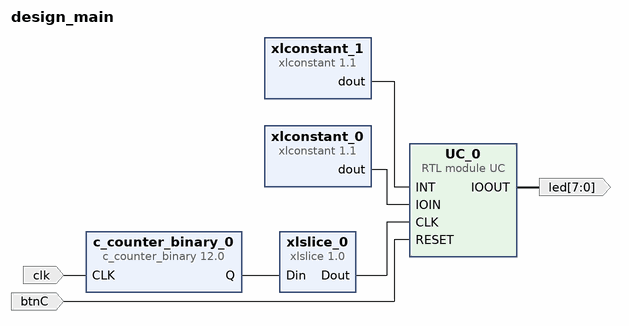
[diagram p0: block diagram of the top level]
# Vivado block design design_main, xc7a35tcpg236-1, Vivado 2020.2
create_bd_design design_main

create_bd_port -dir O -from 7 -to 0 led
create_bd_port -dir I -type clk clk
set_property -dict {CONFIG.FREQ_HZ 10000000} [get_bd_ports clk]
create_bd_port -dir I -type rst btnC

create_bd_cell -type ip -vlnv xilinx.com:ip:c_counter_binary:12.0 c_counter_binary_0
set_property -dict {CONFIG.Output_Width 24 CONFIG.SCLR false} [get_bd_cells c_counter_binary_0]
create_bd_cell -type ip -vlnv xilinx.com:ip:xlslice:1.0 xlslice_0
set_property -dict {CONFIG.DIN_FROM 23 CONFIG.DIN_TO 23 CONFIG.DIN_WIDTH 24} [get_bd_cells xlslice_0]
create_bd_cell -type ip -vlnv xilinx.com:ip:xlconstant:1.1 xlconstant_0
set_property -dict {CONFIG.CONST_VAL 00000000 CONFIG.CONST_WIDTH 8} [get_bd_cells xlconstant_0]
create_bd_cell -type ip -vlnv xilinx.com:ip:xlconstant:1.1 xlconstant_1
set_property -dict {CONFIG.CONST_VAL 0} [get_bd_cells xlconstant_1]
create_bd_cell -type module -reference UC UC_0

# ---- connections ----

connect_bd_net [get_bd_pins xlconstant_1/dout] [get_bd_pins UC_0/INT]
connect_bd_net [get_bd_pins xlconstant_0/dout] [get_bd_pins UC_0/IOIN]
connect_bd_net [get_bd_pins xlslice_0/Dout] [get_bd_pins UC_0/CLK]
connect_bd_net [get_bd_pins c_counter_binary_0/Q] [get_bd_pins xlslice_0/Din]
connect_bd_net [get_bd_ports clk] [get_bd_pins c_counter_binary_0/CLK]
connect_bd_net [get_bd_ports btnC] [get_bd_pins UC_0/RESET]
connect_bd_net [get_bd_pins UC_0/IOOUT] [get_bd_ports led]

validate_bd_design
save_bd_design
